# EAGLE design Lampara (EAGLE 6.3)
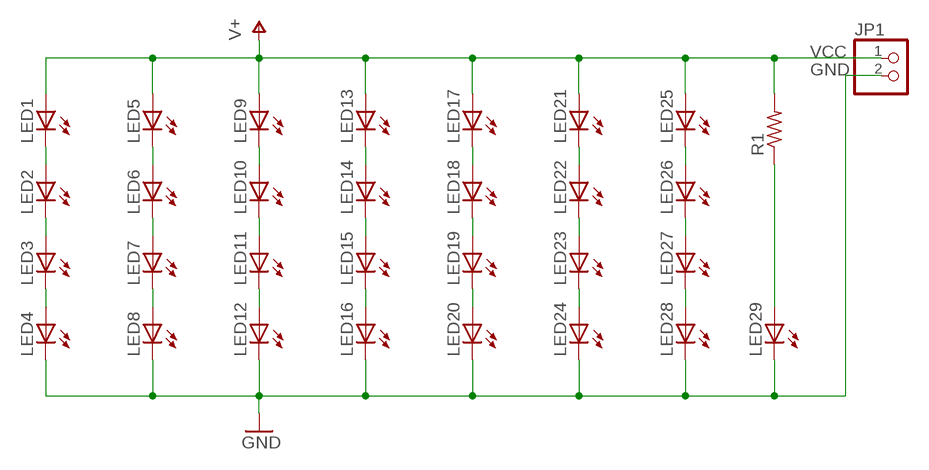
[diagram p0: schematic, sheet 1]

## Parts
JP1  PINHD-1X2/90  [1X02/90]
LED1  LED5MM  [LED5MM]
LED2  LED5MM  [LED5MM]
LED3  LED5MM  [LED5MM]
LED4  LED5MM  [LED5MM]
LED5  LED5MM  [LED5MM]
LED6  LED5MM  [LED5MM]
LED7  LED5MM  [LED5MM]
LED8  LED5MM  [LED5MM]
LED9  LED5MM  [LED5MM]
LED10  LED5MM  [LED5MM]
LED11  LED5MM  [LED5MM]
LED12  LED5MM  [LED5MM]
LED13  LED5MM  [LED5MM]
LED14  LED5MM  [LED5MM]
LED15  LED5MM  [LED5MM]
LED16  LED5MM  [LED5MM]
LED17  LED5MM  [LED5MM]
LED18  LED5MM  [LED5MM]
LED19  LED5MM  [LED5MM]
LED20  LED5MM  [LED5MM]
LED21  LED5MM  [LED5MM]
LED22  LED5MM  [LED5MM]
LED23  LED5MM  [LED5MM]
LED24  LED5MM  [LED5MM]
LED25  LED5MM  [LED5MM]
LED26  LED5MM  [LED5MM]
LED27  LED5MM  [LED5MM]
LED28  LED5MM  [LED5MM]
LED29  LED5MM  [LED5MM]
R1  R-US_0204/7  [0204/7]

## Nets
GND: JP1.2 LED4.K(C) LED8.K(C) LED12.K(C) LED16.K(C) LED20.K(C) LED24.K(C) LED28.K(C) LED29.K(C)
N$1: LED15.K(C) LED16.A
N$2: LED1.K(C) LED2.A
N$3: LED2.K(C) LED3.A
N$4: LED3.K(C) LED4.A
N$5: LED5.K(C) LED6.A
N$6: LED6.K(C) LED7.A
N$7: LED7.K(C) LED8.A
N$8: LED10.K(C) LED11.A
N$9: LED9.K(C) LED10.A
N$10: LED11.K(C) LED12.A
N$11: LED14.K(C) LED15.A
N$12: LED13.K(C) LED14.A
N$13: LED25.K(C) LED26.A
N$14: LED17.K(C) LED18.A
N$15: LED18.K(C) LED19.A
N$16: LED29.A R1.1
N$17: LED19.K(C) LED20.A
N$19: LED22.K(C) LED23.A
N$20: LED23.K(C) LED24.A
N$21: LED27.K(C) LED28.A
N$22: LED26.K(C) LED27.A
N$24: LED21.K(C) LED22.A
VCC [VCC]: JP1.1 LED1.A LED5.A LED9.A LED13.A LED17.A LED21.A LED25.A R1.2 ; supply symbol labelled V+

## Library data of the parts
JP1 = pinhead:PINHD-1X2: PIN HEADER
LED1-LED29 = led:LED: LED OSRAM: - CHIPLED LG R971, LG N971, LY N971, LG Q971, LY Q971, LO R971, LY R971 LH N974, LH R974 LS Q976, LO Q976, LY Q976 LO Q996 - Hyper CHIPLED LW Q18S LB Q993, LB Q99A, LB R99A - SideLED LS A670, LO A670, LY A670, LG A670, LP A670 LB A673, LV A673, LT A673, LW A673 LH A674 LY A675 LS A676, LA A676, LO A676, LY A676, LW A676 LS A679, LY A679, LG A679 - Hyper Micro SIDELED® LS Y876, LA Y876, LO Y876, LY Y876 LT Y87S - SmartLED LW L88C, LW L88S LB L89C, LB L89S, LG L890 LS L89K, LO L89K, LY L89K LS L896, LA L896, LO L896, LY L896 - TOPLED LS T670, LO T670, LY T670, LG T670, LP T670 LSG T670, LSP T670, LSY T670, LOP T670, LYG T670 LG T671, LOG T671, LSG T671 LB T673, LV T673, LT T673, LW T673 LH T674 LS T676, LA T676, LO T676, LY T676, LB T676, LH T676, LSB T676, LW T676 LB T67C, LV T67C, LT T67C, LS T67K, LO T67K, LY T67K, LW E67C LS E67B, LA E67B, LO E67B, LY E67B, LB E67C, LV E67C, LT E67C LW T67C LS T679, LY T679, LG T679 LS T770, LO T770, LY T770, LG T770, LP T770 LB T773, LV T773, LT T773, LW T773 LH T774 LS E675, LA E675, LY E675, LS T675 LS T776, LA T776, LO T776, LY T776, LB T776 LHGB T686 LT T68C, LB T68C - Hyper Mini TOPLED® LB M676 - Mini TOPLED Santana® LG M470 LS M47K, LO M47K, LY M47K Source: http://www.osram.convergy.de LUXEON: - LUMILED® LXK2-PW12-R00, LXK2-PW12-S00, LXK2-PW14-U00, LXK2-PW14-V00 LXK2-PM12-R00, LXK2-PM12-S00, LXK2-PM14-U00 LXK2-PE12-Q00, LXK2-PE12-R00, LXK2-PE12-S00, LXK2-PE14-T00, LXK2-PE14-U00 LXK2-PB12-K00, LXK2-PB12-L00, LXK2-PB12-M00, LXK2-PB14-N00, LXK2-PB14-P00, LXK2-PB14-Q00 LXK2-PR12-L00, LXK2-PR12-M00, LXK2-PR14-Q00, LXK2-PR14-R00 LXK2-PD12-Q00, LXK2-PD12-R00, LXK2-PD12-S00 LXK2-PH12-R00, LXK2-PH12-S00 LXK2-PL12-P00, LXK2-PL12-Q00, LXK2-PL12-R00 Source: www.luxeon.com KINGBRIGHT: KA-3528ASYC Source: www.kingbright.com
R1 = resistor:R-US_: RESISTOR, American symbol

## Net classes
1 VCC: width 0.8 mm

## Board
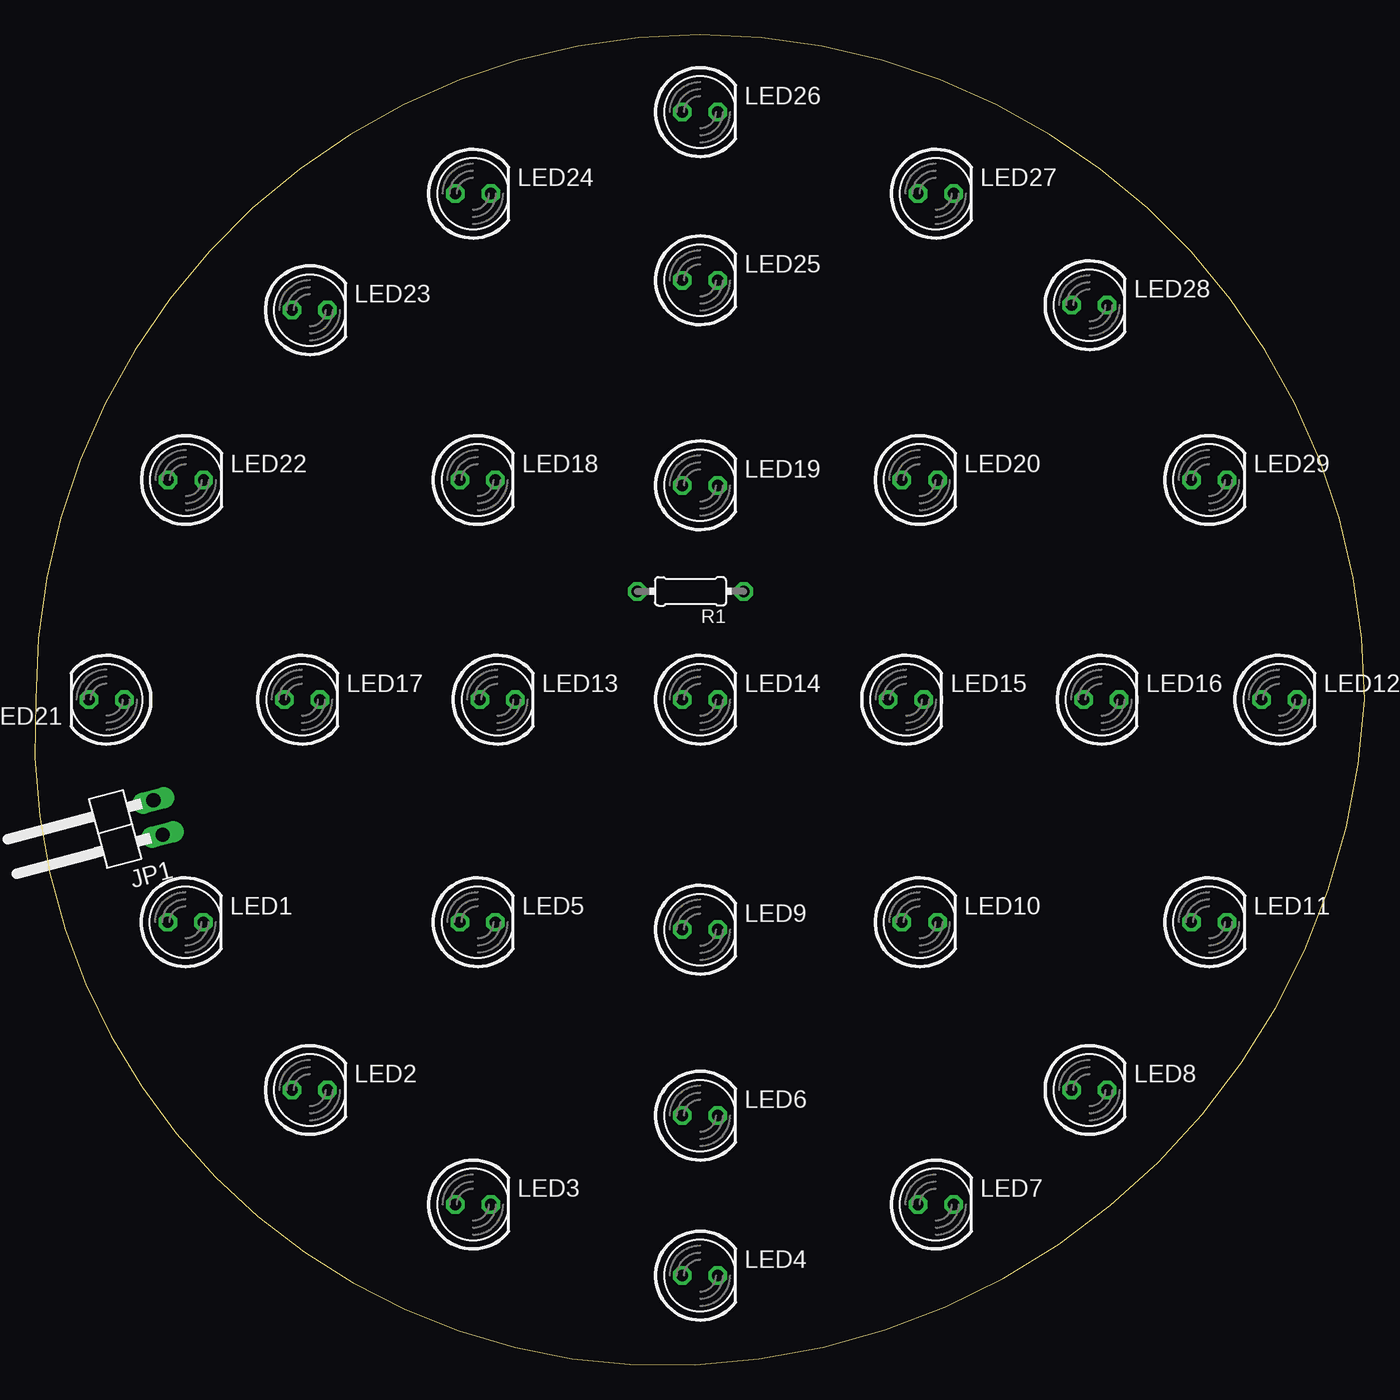
[diagram p1: board, top side]
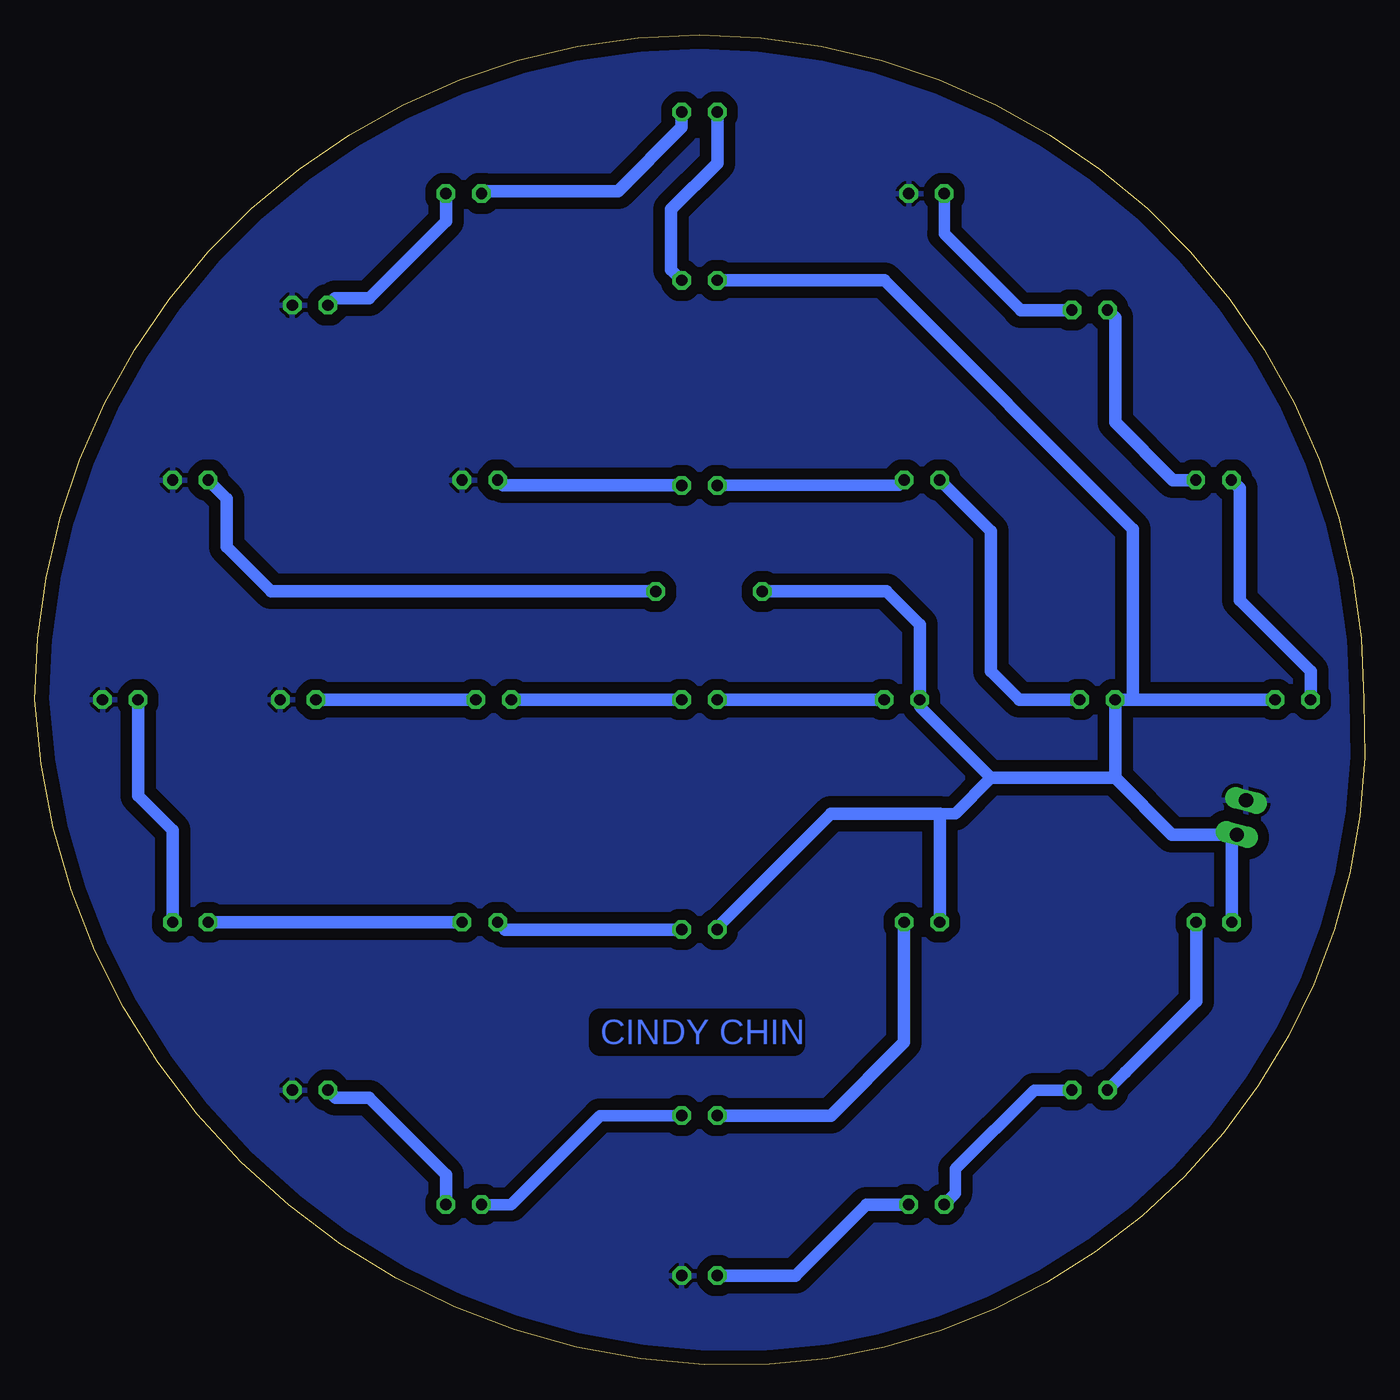
[diagram p2: board, bottom side, seen from below]

Size 95.04 x 95.02 mm. Coordinates in mm from the lower left corner, seen from the top.
Outline: 42.54,0.02 arc90 95.04,47.52 arc90 47.54,95.02 arc90 0.04,47.52 arc90 42.54,0.02
Copper layers (1*16): Top 0.035mm / dielectric 1.5mm / Bottom 0.035mm
Design rules "default": minimum track width 10mil, minimum drill 24mil, track to track 8mil, track to pad 8mil, pad to pad 8mil, via to via 8mil, smd to smd 8mil, copper to edge 40mil, drill to drill 8mil, minimum pad ring 10mil, minimum via ring 8mil, stop-mask expansion 4mil, vias tented up to drill 0mil, thermal gap 10mil

### Footprints (pad centres in the part's own frame; a part is rotated, then mirrored left to right if it is on the bottom)
1X02/90 = drill 1.016 long: 1 -1.27,-3.81; 2 1.27,-3.81
LED5MM = drill 0.813 octagon: A -1.27,0; K 1.27,0
0204/7 = drill 0.813 octagon: 1 -3.81,0; 2 3.81,0

### Placement (x,y rotation side)
JP1  5.12,38.12 105 top
LED1  10.76,31.62 0 top
LED2  19.65,19.63 0 top
LED3  31.31,11.45 0 top
LED4  47.54,6.37 0 top
LED5  31.64,31.62 0 top
LED6  47.54,17.8 0 top
LED7  64.39,11.45 0 top
LED8  75.38,19.63 0 top
LED9  47.54,31.09 0 top
LED10  63.24,31.62 0 top
LED11  83.93,31.62 0 top
LED12  88.94,47.52 0 top
LED13  33.06,47.52 0 top
LED14  47.54,47.52 0 top
LED15  62.27,47.52 0 top
LED16  76.24,47.52 0 top
LED17  19.09,47.52 0 top
LED18  31.64,63.22 0 top
LED19  47.54,62.84 0 top
LED20  63.24,63.22 0 top
LED21  5.12,47.52 180 top
LED22  10.79,63.22 0 top
LED23  19.65,75.36 0 top
LED24  31.31,83.68 0 top
LED25  47.54,77.49 0 top
LED26  47.54,89.51 0 top
LED27  64.39,83.68 0 top
LED28  75.38,75.71 0 top
LED29  83.93,63.22 0 top
R1  46.86,55.26 180 top

### Tracks (layer width: path | path; a pad name or v marks a point on that pad's centre or on a via)
GND
  pour Bottom (isolate 0.813): 0.04,47.52 arc-90 44.49,95.02 47.54,95.02 arc-90 95.04,47.52 arc-90 47.54,0.02 arc-90
N$1
  Bottom 0.9: LED15.K LED16.A
N$2
  Bottom 0.9: 17.11,20.9 LED2.A 12.03,25.98 LED1.K
N$3
  Bottom 0.813: LED2.K 23.61,19.63 29.25,13.99 29.25,12.24 LED3.A
N$4
  Bottom 0.9: LED3.K 35.6,11.45 40.68,6.37 LED4.A
N$5
  Bottom 0.9: LED5.K 32.91,23.03 38.14,17.8 LED6.A
N$6
  Bottom 0.813: LED6.K 54.65,17.8 61,11.45 LED7.A
N$7
  Bottom 0.9: LED7.K 65.66,13.57 71.16,19.07 73.55,19.07 LED8.A
N$8
  Bottom 0.9: LED10.K LED11.A
N$9
  Bottom 0.9: LED9.K 61.44,31.09 LED10.A
N$10
  Bottom 0.9: LED11.K 85.2,38.19 87.67,40.66 LED12.A
N$11
  Bottom 0.9: LED15.A LED14.K
N$12
  Bottom 0.9: LED14.A LED13.K
N$13
  Bottom 0.9: LED26.A 46.27,85.87 49.57,82.57 49.57,78.25 LED25.K
N$14
  Bottom 0.9: LED17.K 24.68,47.52 26.71,49.55 26.71,59.56 LED18.A
N$15
  Bottom 0.813: LED19.A 33.29,62.84 LED18.K
N$16
  Bottom 0.9: R1.1 78.14,55.26 81.32,58.44 81.32,61.88 LED29.A
N$17
  Bottom 0.9: LED19.K 61.59,62.84 LED20.A
N$19
  Bottom 0.9: LED22.K 13.71,63.22 17.82,67.33 17.82,74.8 LED23.A
N$20
  Bottom 0.813: LED24.A 30.04,80.82 24.58,75.36
  Bottom 0.9: LED23.K 24.58,75.36
N$21
  Bottom 0.9: LED27.K 65.66,81.72 71.16,76.22 73.6,76.22 LED28.A
N$22
  Bottom 0.9: LED26.K 48.81,88.41 53.38,83.84 62.96,83.84 LED27.A
N$24
  Bottom 0.9: LED21.K 3.85,49.55 8.93,54.63 8.93,62.63 LED22.A
VCC
  Bottom 0.813: LED13.A 31.79,47.01 26.71,41.93 29.25,39.39 30.37,39.39
  Bottom 0.9: LED21.A 16.55,47.52 | 16.55,47.52 LED17.A 17.82,41.93 | LED13.A 31.79,52.89 34.16,55.26 R1.2 | LED25.A 34.33,77.49 16.55,59.71 16.55,47.52 | 17.82,41.93 13.77,37.88 JP1.1 9.49,37.52 LED1.A | LED5.A 30.37,39.39 38.14,39.39 46.27,31.26 LED9.A | 26.71,41.93 17.82,41.93

### Text on the board
Bottom: CINDY CHIN